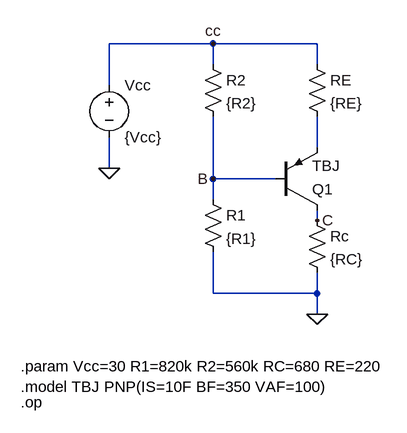
[diagram p0: schematic TBJPNP05CAop.asc]
TBJPNP05CAop.asc, the LTspice schematic file:
Version 4
SHEET 1 1608 1076
WIRE 128 -16 -32 -16
WIRE 288 -16 128 -16
WIRE 128 16 128 -16
WIRE 288 16 288 -16
WIRE -32 48 -32 -16
WIRE 288 144 288 96
WIRE -32 176 -32 128
WIRE 128 192 128 96
WIRE 224 192 128 192
WIRE 128 224 128 192
WIRE 288 256 288 240
WIRE 128 368 128 304
WIRE 288 368 288 336
WIRE 288 368 128 368
WIRE 288 400 288 368
FLAG -32 176 0
FLAG 288 400 0
FLAG 128 -16 cc
FLAG 128 192 B
FLAG 288 256 C
SYMBOL res 112 208 R0
SYMATTR InstName R1
SYMATTR Value {R1}
SYMBOL res 272 240 R0
SYMATTR InstName Rc
SYMATTR Value {RC}
SYMBOL voltage -32 32 R0
WINDOW 123 0 0 Left 0
WINDOW 39 0 0 Left 0
SYMATTR InstName Vcc
SYMATTR Value {Vcc}
SYMBOL res 272 0 R0
SYMATTR InstName RE
SYMATTR Value {RE}
SYMBOL res 112 0 R0
SYMATTR InstName R2
SYMATTR Value {R2}
SYMBOL pnp 224 240 M180
SYMATTR InstName Q1
SYMATTR Value TBJ
TEXT -168 480 Left 2 !.param Vcc=30 R1=820k R2=560k RC=680 RE=220
TEXT -168 536 Left 2 !.op
TEXT -168 512 Left 2 !.model TBJ PNP(IS=10F BF=350 VAF=100)

The netlist it stands for:
* TBJPNP05CAop.asc
R1 B 0 {R1}
Rc C 0 {RC}
Vcc cc 0 {Vcc}
RE cc N001 {RE}
R2 cc B {R2}
Q1 C B N001 0 TBJ
.model NPN NPN
.model PNP PNP
.lib standard.bjt
.param Vcc=30 R1=820k R2=560k RC=680 RE=220
.op
.model TBJ PNP(IS=10F BF=350 VAF=100)
.backanno
.end